# Altium schematic sheet 12_Energy_storage.SchDoc
size 420 x 297 mm; Author: Shpakov Dmitry; Address1: Address1; Address2: Address2; Address3: Address3; Address4: Address4; DocumentNumber: АБВГ.123456.001 Э3; SheetNumber: 13; SheetTotal: 13; Scale: 1:1; DocumentType: Схема электрическая принципиальная; FirstReferrence: АБВГ.123456.001
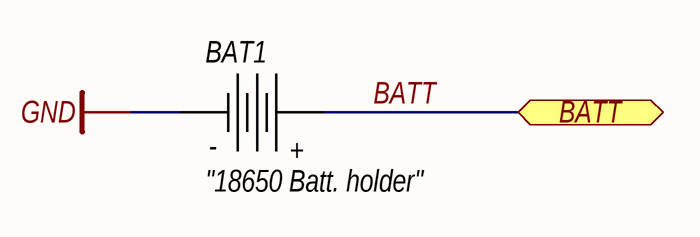
[diagram p0: 12_Energy_storage.SchDoc]

## Parts
BAT1  "18650 Batt. holder"  [18650_smd_keystone_1042]

## Ports
BATT

## Nets
GND: BAT1.1
BATT: BAT1.2 ; port BATT

## Notes on the sheet
- Author
- Manufacturer
- Date
- Page
- Total pages
- Size page
- A3
- Materials
- (in symbol SMD_battery_holder_18650) -; +

## Library data of the parts
BAT1 = SMD_battery_holder_18650: Battery holder 18650 SMD.; Manufacturer: Keystone Electronics; PartNumber: 1042; Operation Temperature: -50...+145; Help URL: https://www.digikey.com/en/products/detail/keystone-electronics/1042/2745668; Power/Voltage: *; Type: battery holder; Value: *; Tolerance: *; Note: *; Case: 18650